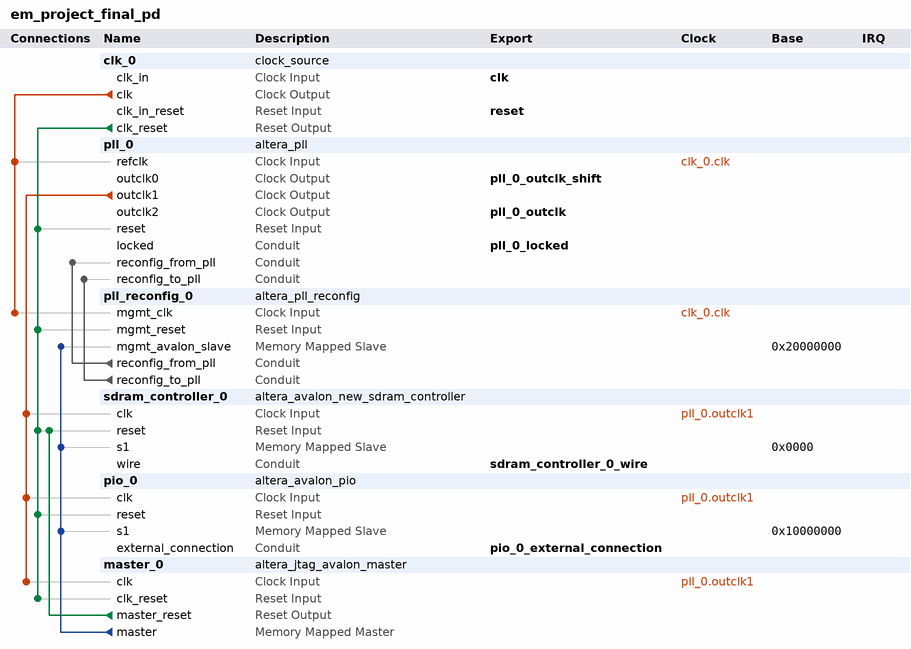
[diagram p0: system contents]
# Platform Designer (Qsys) system em_project_final_pd, Cyclone V 5CSXFC6D6F31C6
# Parameters at their usual value, and those the tool derives, are not listed.
package require -exact qsys 20.1
create_system em_project_final_pd
set_project_property DEVICE_FAMILY {Cyclone V}
set_project_property DEVICE 5CSXFC6D6F31C6

add_instance clk_0 clock_source 20.1
set_instance_parameter_value clk_0 clockFrequency 50000000

add_instance pll_0 altera_pll 20.1
set_instance_parameter_value pll_0 gui_device_speed_grade 1
set_instance_parameter_value pll_0 gui_en_reconf true
set_instance_parameter_value pll_0 gui_number_of_clocks 3
set_instance_parameter_value pll_0 gui_operation_mode direct
set_instance_parameter_value pll_0 gui_output_clock_frequency0 143.0
set_instance_parameter_value pll_0 gui_output_clock_frequency1 143.0
set_instance_parameter_value pll_0 gui_output_clock_frequency2 143.0
set_instance_parameter_value pll_0 gui_phase_shift0 -3000
set_instance_parameter_value pll_0 gui_pll_mode {Integer-N PLL}
set_instance_parameter_value pll_0 gui_reference_clock_frequency 50.0
set_instance_parameter_value pll_0 gui_use_locked true

add_instance pll_reconfig_0 altera_pll_reconfig 20.1

add_instance sdram_controller_0 altera_avalon_new_sdram_controller 20.1
set_instance_parameter_value sdram_controller_0 TAC 5.5
set_instance_parameter_value sdram_controller_0 TRCD 15.0
set_instance_parameter_value sdram_controller_0 TRFC 55.0
set_instance_parameter_value sdram_controller_0 TRP 15.0
set_instance_parameter_value sdram_controller_0 casLatency 2
set_instance_parameter_value sdram_controller_0 columnWidth 10
set_instance_parameter_value sdram_controller_0 dataWidth 16
set_instance_parameter_value sdram_controller_0 generateSimulationModel false
set_instance_parameter_value sdram_controller_0 initRefreshCommands 8
set_instance_parameter_value sdram_controller_0 model single_Micron_MT48LC4M32B2_7_chip
set_instance_parameter_value sdram_controller_0 numberOfBanks 4
set_instance_parameter_value sdram_controller_0 numberOfChipSelects 1
set_instance_parameter_value sdram_controller_0 powerUpDelay 100.0
set_instance_parameter_value sdram_controller_0 refreshPeriod 7.8
set_instance_parameter_value sdram_controller_0 rowWidth 13

add_instance pio_0 altera_avalon_pio 20.1
set_instance_parameter_value pio_0 direction Output
set_instance_parameter_value pio_0 width 10

add_instance master_0 altera_jtag_avalon_master 20.1

# connections
add_connection clk_0.clk pll_0.refclk clock
add_connection clk_0.clk pll_reconfig_0.mgmt_clk clock
add_connection pll_0.outclk1 master_0.clk clock
add_connection pll_0.outclk1 pio_0.clk clock
add_connection pll_0.outclk1 sdram_controller_0.clk clock
add_connection clk_0.clk_reset master_0.clk_reset reset
add_connection clk_0.clk_reset pio_0.reset reset
add_connection clk_0.clk_reset pll_0.reset reset
add_connection clk_0.clk_reset pll_reconfig_0.mgmt_reset reset
add_connection clk_0.clk_reset sdram_controller_0.reset reset
add_connection master_0.master_reset sdram_controller_0.reset reset
add_connection master_0.master pio_0.s1 avalon
set_connection_parameter_value master_0.master/pio_0.s1 baseAddress 0x10000000
add_connection master_0.master pll_reconfig_0.mgmt_avalon_slave avalon
set_connection_parameter_value master_0.master/pll_reconfig_0.mgmt_avalon_slave baseAddress 0x20000000
add_connection master_0.master sdram_controller_0.s1 avalon
set_connection_parameter_value master_0.master/sdram_controller_0.s1 baseAddress 0x0000
add_connection pll_reconfig_0.reconfig_from_pll pll_0.reconfig_from_pll conduit
add_connection pll_reconfig_0.reconfig_to_pll pll_0.reconfig_to_pll conduit

# exported interfaces
add_interface clk clock sink
set_interface_property clk EXPORT_OF clk_0.clk_in
add_interface pio_0_external_connection conduit end
set_interface_property pio_0_external_connection EXPORT_OF pio_0.external_connection
add_interface pll_0_locked conduit end
set_interface_property pll_0_locked EXPORT_OF pll_0.locked
add_interface pll_0_outclk clock source
set_interface_property pll_0_outclk EXPORT_OF pll_0.outclk2
add_interface pll_0_outclk_shift clock source
set_interface_property pll_0_outclk_shift EXPORT_OF pll_0.outclk0
add_interface reset reset sink
set_interface_property reset EXPORT_OF clk_0.clk_in_reset
add_interface sdram_controller_0_wire conduit end
set_interface_property sdram_controller_0_wire EXPORT_OF sdram_controller_0.wire

set_interconnect_requirement {$system} qsys_mm.clockCrossingAdapter HANDSHAKE
set_interconnect_requirement {$system} qsys_mm.enableEccProtection FALSE
set_interconnect_requirement {$system} qsys_mm.insertDefaultSlave FALSE
set_interconnect_requirement {$system} qsys_mm.maxAdditionalLatency 1

save_system em_project_final_pd.qsys
